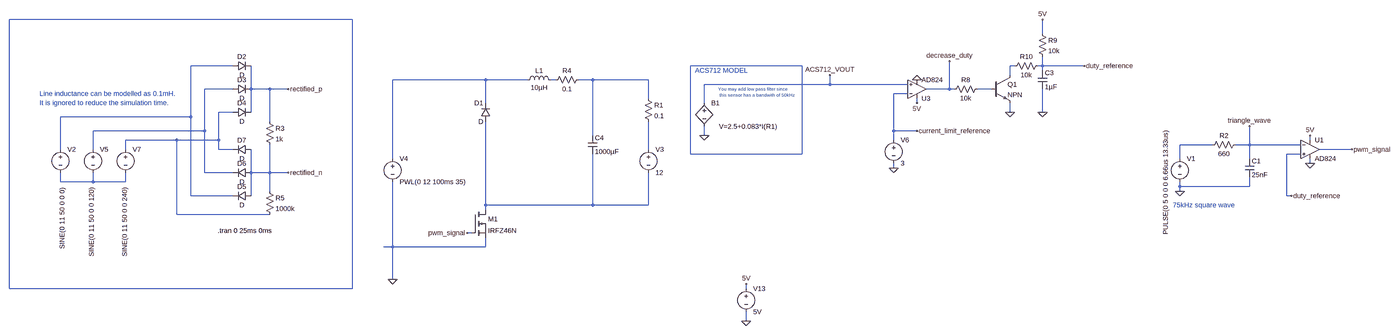
[diagram p0: schematic buck converter- analog control - ACS712 model.asc, whole sheet]
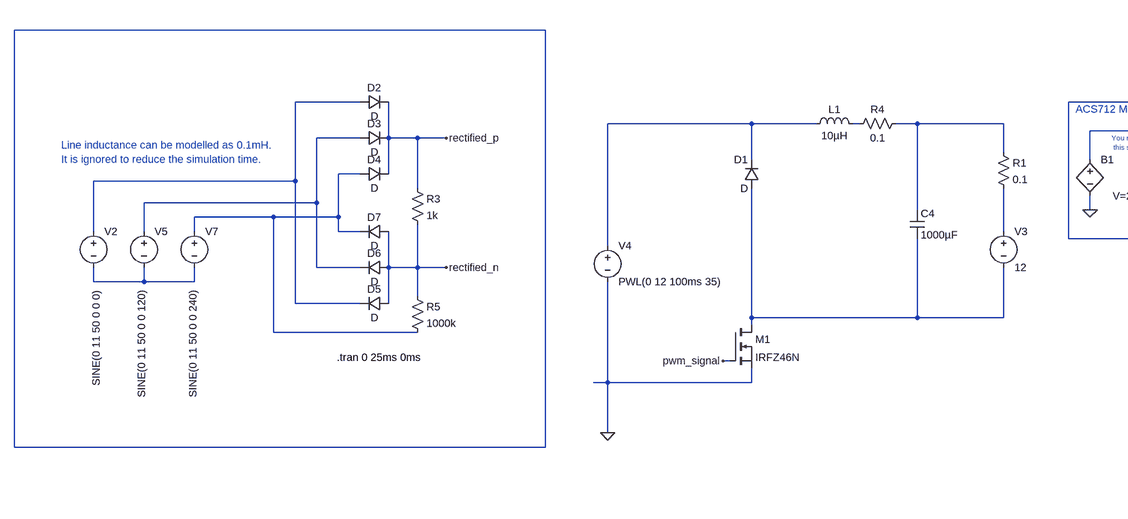
[diagram p1: schematic buck converter- analog control - ACS712 model.asc, part, row 1 of 1, column 1 of 2]
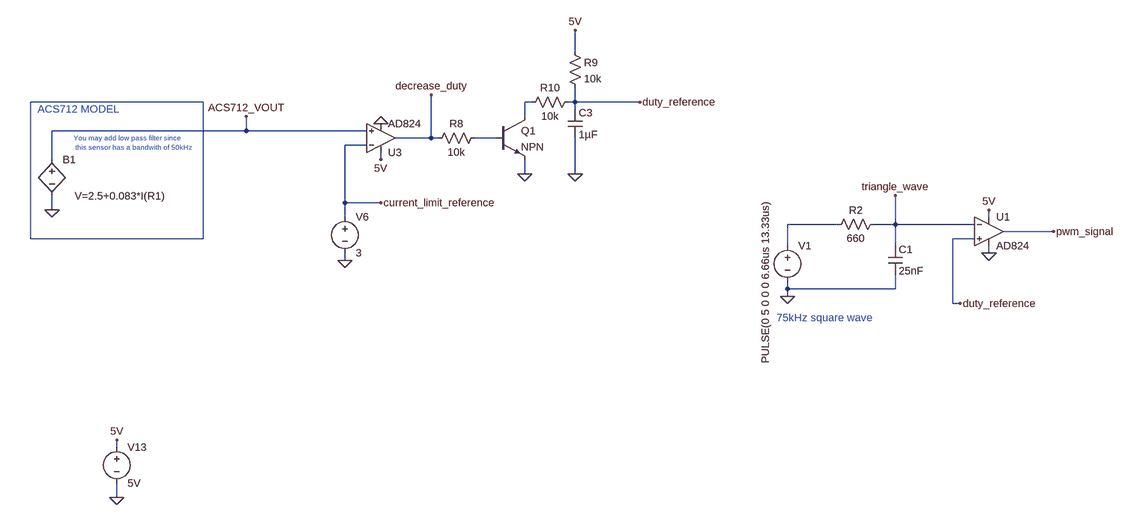
[diagram p2: schematic buck converter- analog control - ACS712 model.asc, part, row 1 of 1, column 2 of 2]
buck converter- analog control - ACS712 model.asc, the LTspice schematic file:
Version 4
SHEET 1 3984 1324
WIRE -352 -288 -1552 -288
WIRE 2320 -240 2320 -288
WIRE -784 -128 -928 -128
WIRE 1456 -128 1072 -128
WIRE 2224 -128 2208 -128
WIRE 2320 -128 2320 -160
WIRE 2320 -128 2304 -128
WIRE 2464 -128 2320 -128
WIRE 2320 -112 2320 -128
WIRE 2208 -96 2208 -128
WIRE 368 -80 48 -80
WIRE 512 -80 368 -80
WIRE 608 -80 592 -80
WIRE 736 -80 688 -80
WIRE 928 -80 736 -80
WIRE 1552 -64 1552 -96
WIRE 1552 -64 1120 -64
WIRE 1856 -64 1552 -64
WIRE -784 -48 -880 -48
WIRE -720 -48 -720 -128
WIRE -656 -48 -720 -48
WIRE -592 -48 -656 -48
WIRE 2000 -48 2000 -144
WIRE 2000 -48 1920 -48
WIRE 2016 -48 2000 -48
WIRE 2144 -48 2096 -48
WIRE 1856 -32 1808 -32
WIRE 928 -16 928 -80
WIRE 368 0 368 -80
WIRE 1120 0 1120 -64
WIRE 1888 0 1888 -16
WIRE -784 32 -832 32
WIRE -720 32 -720 -48
WIRE 2208 32 2208 0
WIRE 2320 32 2320 -48
WIRE -928 48 -928 -128
WIRE -928 48 -1376 48
WIRE -656 64 -656 -48
WIRE -880 96 -880 -48
WIRE -880 96 -1264 96
WIRE 1808 96 1808 -32
WIRE 1888 96 1808 96
WIRE 736 112 736 -80
WIRE 1120 112 1120 80
WIRE -976 128 -1152 128
WIRE -832 128 -832 32
WIRE -832 128 -976 128
WIRE 1808 128 1808 96
WIRE 3680 128 3680 112
WIRE 3344 144 3232 144
WIRE 3472 144 3472 80
WIRE 3472 144 3424 144
WIRE 3648 144 3472 144
WIRE -1376 160 -1376 48
WIRE -1264 160 -1264 96
WIRE -1152 160 -1152 128
WIRE -832 160 -832 128
WIRE -784 160 -832 160
WIRE 928 160 928 64
WIRE 3824 160 3712 160
WIRE 1072 176 1072 -128
WIRE 1456 176 1456 -128
WIRE 1456 176 1072 176
WIRE 3648 176 3600 176
WIRE 48 192 48 -80
WIRE 3232 192 3232 144
WIRE 3472 192 3472 144
WIRE 3680 208 3680 192
WIRE 1808 224 1808 208
WIRE -880 240 -880 96
WIRE -784 240 -880 240
WIRE -720 240 -720 160
WIRE -656 240 -656 144
WIRE -656 240 -720 240
WIRE -592 240 -656 240
WIRE -1376 272 -1376 240
WIRE -1264 272 -1264 240
WIRE -1264 272 -1376 272
WIRE -1152 272 -1152 240
WIRE -1152 272 -1264 272
WIRE 3232 288 3232 272
WIRE 3472 288 3472 256
WIRE 3472 288 3232 288
WIRE -656 304 -656 240
WIRE 3232 304 3232 288
WIRE -928 320 -928 48
WIRE -784 320 -928 320
WIRE -720 320 -720 240
WIRE 3600 320 3600 176
WIRE 3616 320 3600 320
WIRE 368 352 368 64
WIRE 736 352 736 176
WIRE 736 352 368 352
WIRE 928 352 928 240
WIRE 928 352 736 352
WIRE 368 368 368 352
WIRE -976 384 -976 128
WIRE -656 384 -976 384
WIRE 320 448 304 448
WIRE 48 496 48 272
WIRE 48 496 16 496
WIRE 368 496 368 464
WIRE 368 496 48 496
WIRE 48 608 48 496
WIRE -1552 640 -1552 -288
WIRE -352 640 -352 -288
WIRE -352 640 -1552 640
WIRE 1264 640 1264 624
WIRE 1264 752 1264 720
FLAG 1264 752 0
FLAG 1264 624 5V
FLAG 3232 304 0
FLAG 3680 208 0
FLAG 3680 112 5V
FLAG 48 608 0
FLAG 1888 -80 0
FLAG 1888 0 5V
FLAG 1808 224 0
FLAG 2208 32 0
FLAG 2320 32 0
FLAG 2320 -288 5V
FLAG 2000 -144 decrease_duty
FLAG 2464 -128 duty_reference
FLAG 3616 320 duty_reference
FLAG 3824 160 pwm_signal
FLAG 304 448 pwm_signal
FLAG 1888 96 current_limit_reference
FLAG 3472 80 triangle_wave
FLAG -592 -48 rectified_p
FLAG -592 240 rectified_n
FLAG 1120 112 0
FLAG 1552 -96 ACS712_VOUT
SYMBOL nmos 320 368 R0
SYMATTR InstName M1
SYMATTR Value IRFZ46N
SYMBOL diode 384 64 R180
WINDOW 0 24 64 Left 2
WINDOW 3 24 0 Left 2
SYMATTR InstName D1
SYMBOL ind 496 -64 R270
WINDOW 0 32 56 VTop 2
WINDOW 3 5 56 VBottom 2
SYMATTR InstName L1
SYMATTR Value 10µH
SYMBOL voltage 928 144 R0
WINDOW 123 0 0 Left 0
WINDOW 39 0 0 Left 0
SYMATTR InstName V3
SYMATTR Value 12
SYMBOL res 912 -32 R0
SYMATTR InstName R1
SYMATTR Value 0.1
SYMBOL res 704 -96 R90
WINDOW 0 0 56 VBottom 2
WINDOW 3 32 56 VTop 2
SYMATTR InstName R4
SYMATTR Value 0.1
SYMBOL voltage 1264 624 R0
WINDOW 123 0 0 Left 0
WINDOW 39 0 0 Left 0
SYMATTR InstName V13
SYMATTR Value 5V
SYMBOL voltage 3232 176 R0
WINDOW 3 -48 -83 VRight 2
WINDOW 123 0 0 Left 0
WINDOW 39 0 0 Left 0
SYMATTR Value PULSE(0 5 0 0 0 6.66us 13.33us)
SYMATTR InstName V1
SYMBOL res 3440 128 R90
WINDOW 0 0 56 VBottom 2
WINDOW 3 32 56 VTop 2
SYMATTR InstName R2
SYMATTR Value 660
SYMBOL cap 3456 192 R0
SYMATTR InstName C1
SYMATTR Value 25nF
SYMBOL OpAmps\\AD824 3680 96 R0
SYMATTR InstName U1
SYMBOL OpAmps\\AD824 1888 16 M180
SYMATTR InstName U3
SYMBOL voltage 1808 112 R0
WINDOW 123 0 0 Left 0
WINDOW 39 0 0 Left 0
SYMATTR InstName V6
SYMATTR Value 3
SYMBOL npn 2144 -96 R0
SYMATTR InstName Q1
SYMBOL cap 2304 -112 R0
SYMATTR InstName C3
SYMATTR Value 1µF
SYMBOL res 2304 -256 R0
SYMATTR InstName R9
SYMATTR Value 10k
SYMBOL res 2112 -64 R90
WINDOW 0 0 56 VBottom 2
WINDOW 3 32 56 VTop 2
SYMATTR InstName R8
SYMATTR Value 10k
SYMBOL res 2320 -144 R90
WINDOW 0 0 56 VBottom 2
WINDOW 3 32 56 VTop 2
SYMATTR InstName R10
SYMATTR Value 10k
SYMBOL voltage -1376 144 R0
WINDOW 3 6 146 VRight 2
WINDOW 123 0 0 Left 0
WINDOW 39 0 0 Left 0
SYMATTR Value SINE(0 11 50 0 0 0)
SYMATTR InstName V2
SYMBOL voltage -1264 144 R0
WINDOW 3 -5 145 VRight 2
WINDOW 123 0 0 Left 0
WINDOW 39 0 0 Left 0
SYMATTR Value SINE(0 11 50 0 0 120)
SYMATTR InstName V5
SYMBOL voltage -1152 144 R0
WINDOW 3 -3 145 VRight 2
WINDOW 123 0 0 Left 0
WINDOW 39 0 0 Left 0
SYMATTR Value SINE(0 11 50 0 0 240)
SYMATTR InstName V7
SYMBOL diode -784 -112 R270
WINDOW 0 32 32 VTop 2
WINDOW 3 0 32 VBottom 2
SYMATTR InstName D2
SYMBOL diode -784 -32 R270
WINDOW 0 32 32 VTop 2
WINDOW 3 0 32 VBottom 2
SYMATTR InstName D3
SYMBOL diode -784 48 R270
WINDOW 0 32 32 VTop 2
WINDOW 3 0 32 VBottom 2
SYMATTR InstName D4
SYMBOL diode -720 304 R90
WINDOW 0 0 32 VBottom 2
WINDOW 3 32 32 VTop 2
SYMATTR InstName D5
SYMBOL diode -720 224 R90
WINDOW 0 0 32 VBottom 2
WINDOW 3 32 32 VTop 2
SYMATTR InstName D6
SYMBOL diode -720 144 R90
WINDOW 0 0 32 VBottom 2
WINDOW 3 32 32 VTop 2
SYMATTR InstName D7
SYMBOL cap 720 112 R0
SYMATTR InstName C4
SYMATTR Value 1000µF
SYMBOL bv 1120 -16 R0
WINDOW 3 252 97 Right 2
SYMATTR InstName B1
SYMATTR Value V=2.5+0.083*I(R1)
SYMBOL res -672 48 R0
SYMATTR InstName R3
SYMATTR Value 1k
SYMBOL voltage 48 176 R0
WINDOW 123 0 0 Left 0
WINDOW 39 0 0 Left 0
SYMATTR InstName V4
SYMATTR Value PWL(0 12 100ms 35)
SYMBOL res -672 288 R0
SYMATTR InstName R5
SYMATTR Value 1000k
TEXT 3208 352 Left 2 ;75kHz square wave
TEXT -648 440 Right 2 !.tran 0 25ms 0ms
TEXT -1448 -32 Left 2 ;Line inductance can be modelled as 0.1mH.\nIt is ignored to reduce the simulation time.
TEXT 1088 -112 Left 2 ;ACS712 MODEL
TEXT 1168 -48 Left 1 ;You may add low pass filter since\n this sensor has a bandwith of 50kHz

The netlist it stands for:
* buck converter- analog control - ACS712 model.asc
M1 N014 pwm_signal 0 0 IRFZ46N
D1 N014 N005 D
L1 N005 N006 10µH
V3 N012 N014 12
R1 N007 N012 0.1
R4 N007 N006 0.1
V13 5V 0 5V
V1 N011 0 PULSE(0 5 0 0 0 6.66us 13.33us)
R2 triangle_wave N011 660
C1 triangle_wave 0 25nF
XU1 duty_reference triangle_wave 5V 0 pwm_signal AD824  ; pins In+ In- V+ V- OUT
XU3 ACS712_VOUT current_limit_reference 5V 0 decrease_duty AD824  ; pins In+ In- V+ V- OUT
V6 current_limit_reference 0 3
Q1 N004 N009 0 0 NPN
C3 duty_reference 0 1µF
R9 5V duty_reference 10k
R8 N009 decrease_duty 10k
R10 duty_reference N004 10k
V2 N002 N013 SINE(0 11 50 0 0 0)
V5 N008 N013 SINE(0 11 50 0 0 120)
V7 N010 N013 SINE(0 11 50 0 0 240)
D2 N002 rectified_p D
D3 N008 rectified_p D
D4 N010 rectified_p D
D5 rectified_n N002 D
D6 rectified_n N008 D
D7 rectified_n N010 D
C4 N007 N014 1000µF
B1 ACS712_VOUT 0 V=2.5+0.083*I(R1)
R3 rectified_p rectified_n 1k
V4 N005 0 PWL(0 12 100ms 35)
R5 rectified_n N010 1000k
.model D D
.lib standard.dio
.model NPN NPN
.model PNP PNP
.lib standard.bjt
.model NMOS NMOS
.model PMOS PMOS
.lib standard.mos
* 75kHz square wave
.tran 0 25ms 0ms
* Line inductance can be modelled as 0.1mH.
* It is ignored to reduce the simulation time.
* ACS712 MODEL
* You may add low pass filter since
*  this sensor has a bandwith of 50kHz
.backanno
.end